# Altium schematic sheet CAN_Module.SchDoc
size A4; Author: Wojciech Grędel; Revision: 1
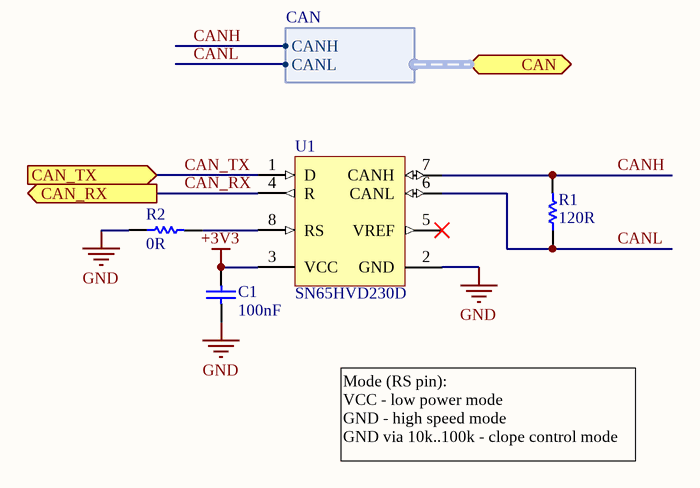
[diagram p0: CAN_Module.SchDoc]

## Parts
C1  value 100nF  [CAP_0805_IPC_MD]  (hidden comment: Cap)
R1  value 120R  [RES_1206_IPC_MD]  (hidden comment: Res)
R2  value 0R  [RES_0805_IPC_MD]  (hidden comment: Res)
U1  SN65HVD230D  [SOIC_8_IPC_MD]

## Ports
CAN (harness CAN), CAN_RX (out), CAN_TX (in)

## Harnesses
CAN: CANH, CANL

## Nets
+3V3: C1.2 U1.3(VCC)
GND: C1.1 R2.1 U1.2(GND)
CAN_RX: U1.4(R) ; port CAN_RX
CAN_TX: U1.1(D) ; port CAN_TX
CANH: R1.2 U1.7(CANH) ; port CAN.CANH
CANL: R1.1 U1.6(CANL) ; port CAN.CANL
NetR2_2: R2.2 U1.8(RS)

Not connected (* = marked no-connect by the designer): U1 5(VREF)*

## Notes on the sheet
- Mode (RS pin):
  VCC - low power mode
  GND - high speed mode
  GND via 10k..100k - clope control mode
- Confidential / Not for distribution !
- Project name:
- Document name:
- Designer Name:
- Date/Time:
- Revision:

## Library data of the parts
C1 = Cap: Capacitor; Manufacturer: Samsung; Supplier Part Number: CL21B104KBCNNNC; Supplier: TME
R1 R2 = Res: Resistor; Supplier: *; Supplier Part Number: *; Manufacturer: *
U1 = SN65HVD230DR: 3.3V CAN Transceiver with Standby Mode, 17 mA, -40 to 85 degC, 8-pin SOIC (D), Green (RoHS & no Sb/Br); Manufacturer: Texas Instruments; Drivers Per Package: 1; Transient Pulse Protection(V): -25 to 25; ICC(Max)(mA): 17; Supply Voltage(s)(V): 3.3; Rating: Catalog; DatasheetVersion: SLOS346K; PackageVersion: revM, Jun-2011; PackageReference: D8; PackageDescription: 8-Pin Plastic Small Outline Integrated Circuit, 4.9 x 3.9 mm, Pitch 1.27 mm Pitch; Supplier 1: Digi-Key; Supplier Part Number 1: 296-11654-2-ND; Supplier 2: Digi-Key; Supplier Part Number 2: 296-11654-1-ND; Supplier 3: Digi-Key; Supplier Part Number 3: 296-11654-6-ND; Supplier 4: Farnell; Supplier Part Number 4: 8452148RL; Supplier 5: Farnell; Supplier Part Number 5: 8452148; Supplier 6: Newark; Supplier Part Number 6: 75C7745; Supplier 7: Mouser; Supplier Part Number 7: 595-SN65HVD230DR; Eco-Plan: Green (RoHS & no Sb/Br); SubFamily: CAN; Receivers Per Package: 1; Isolated: No; Low Power Mode: Standby; Footprint: PCA82C250; Mounting Technology: Surface Mount; PartNumber: SN65HVD230DR; Code_JEDEC: MS-012AA; ComponentLink1Description: Datasheet; ComponentLink1URL: http://www.ti.com/general/docs/lit/getliterature.tsp?genericPartNumber=SN65HVD230&fileType=pdf; Supplier Part Number: SN65HVD230D; Supplier: TME